# EAGLE schematic brick_serial_zigbee (EAGLE 7.2.0)
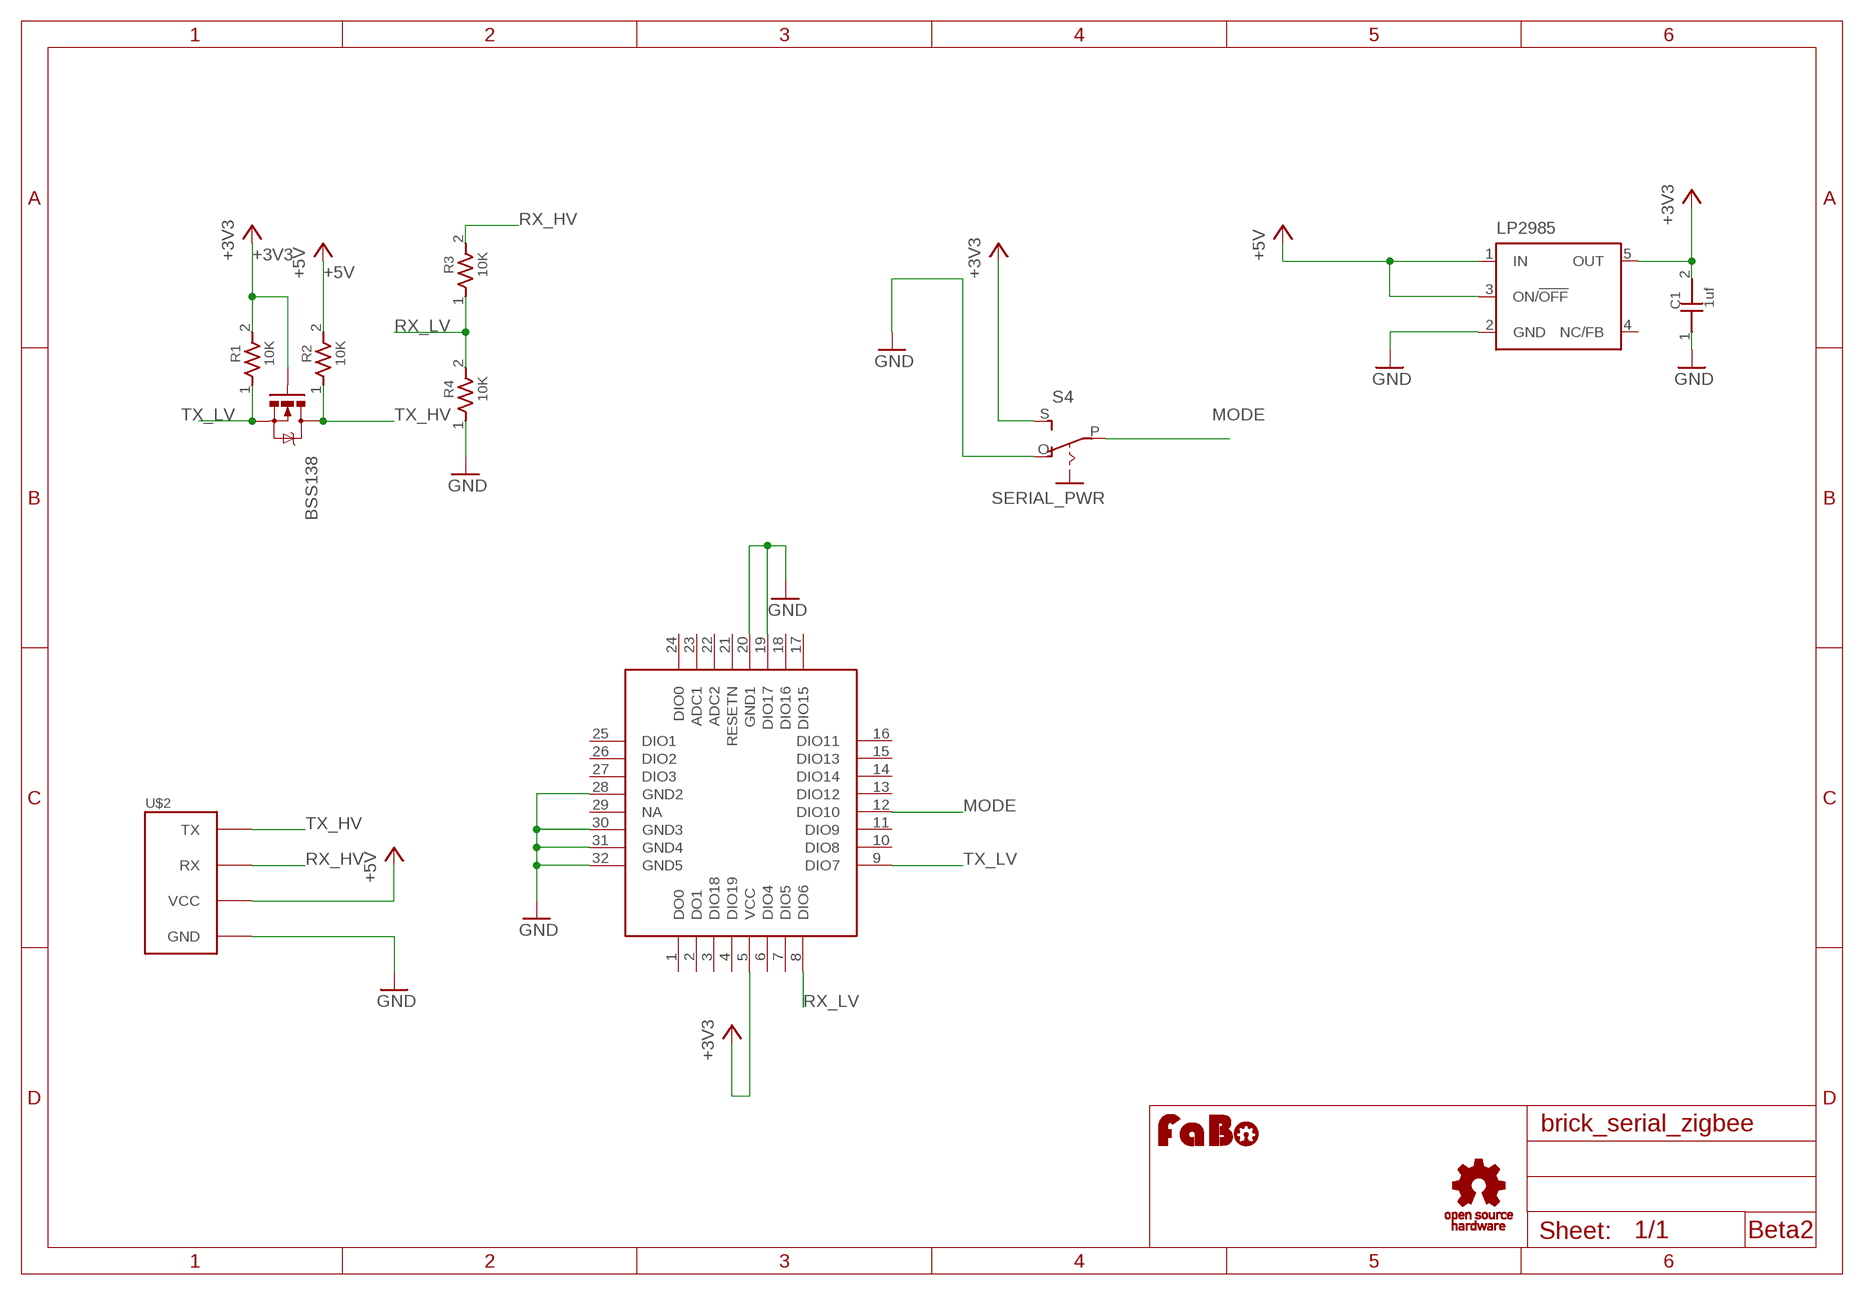
[diagram p0: schematic, sheet 1]

## Parts
BSS138  MOSFET-NCHANNELSMD  [SOT23-3]
C1  1uf  CAPACITOR0603  [0603]
LP2985  LP2985-XXDBVR33  [SOT23-DBV]
R1  10K  RESISTOR0603  [0603]
R2  10K  RESISTOR0603  [0603]
R3  10K  RESISTOR0603  [0603]
R4  10K  RESISTOR0603  [0603]
S4  SERIAL_PWR  EG1218S  [EG1218]
U$2  BRICK_SERIAL  [BRICK_SERIAL]
U$3  TOCOS-TWE001L  [TOCOS-TWE001L]
U$4  LOGO_FABO-S  [LOGO_FABO_S]
U$5  LOGO_OSHW_T-S  [LOGO_OSHW_T_S]

## Nets
+3V3: BSS138.1(G) C1.2 LP2985.5(OUT) R1.2 S4.S U$3.5(VCC)
+5V: LP2985.1(IN) LP2985.3(ON/!OFF) R2.2 U$2.VCC
GND: C1.1 LP2985.2(GND) R4.1 S4.O U$2.GND U$3.19(DIO17) U$3.20(GND1) U$3.28(GND2) U$3.30(GND3) U$3.31(GND4) U$3.32(GND5)
MODE: S4.P U$3.12(DIO10)
RX_HV: R3.2 U$2.RX
RX_LV: R3.1 R4.2 U$3.8(DIO6)
TX_HV: BSS138.3(D) R2.1 U$2.TX
TX_LV: BSS138.2(S) R1.1 U$3.9(DIO7)
Unconnected: LP2985.4(NC/FB) U$3.1(DO0) U$3.2(DO1) U$3.3(DIO18) U$3.4(DIO19) U$3.6(DIO4) U$3.7(DIO5) U$3.10(DIO8) U$3.11(DIO9) U$3.13(DIO12) U$3.14(DIO14) U$3.15(DIO13) U$3.16(DIO11) U$3.17(DIO15) U$3.18(DIO16) U$3.21(RESETN) U$3.22(ADC2) U$3.23(ADC1) U$3.24(DIO0) U$3.25(DIO1) U$3.26(DIO2) U$3.27(DIO3) U$3.29(NA)

## Notes on the sheet
- Beta2

## Library data of the parts
BSS138 = SparkFun:MOSFET-NCHANNEL
C1 = GClue-Capacitor:CAPACITOR
LP2985 = SmartPrj:LP2985-XXDBVR: ULTRALOW-POWER 50-mA LOW-DROPOUT LINEAR REGULATORS 50-mA Low-Dropout Regulator Source: http://focus.ti.com/lit/ds/symlink/tps77001.pdf
R1-R4 = GClue-Resistors:RESISTOR
S4 = adafruit:EG1218: SLIDING SWITCH 0.1" spacing through hole, vertical SPDT slide switch http://www.ladyada.net/library/pcb/eaglelibrary.html
U$2 = gclue:BRICK_SERIAL: FaBo Brick 4pin(SERIAL)
U$3 = gclueZigbee:TOCOS-TWE001L
U$4 = FaBo:LOGO_FABO
U$5 = gclue:LOGO_OSHW_T

## Net classes
0 default: clearance 0.254 mm